# EasyEDA Pro project ProProject_Shield na MachXO3 devboard_2024-06-21.epro

# Schematic Schematic1
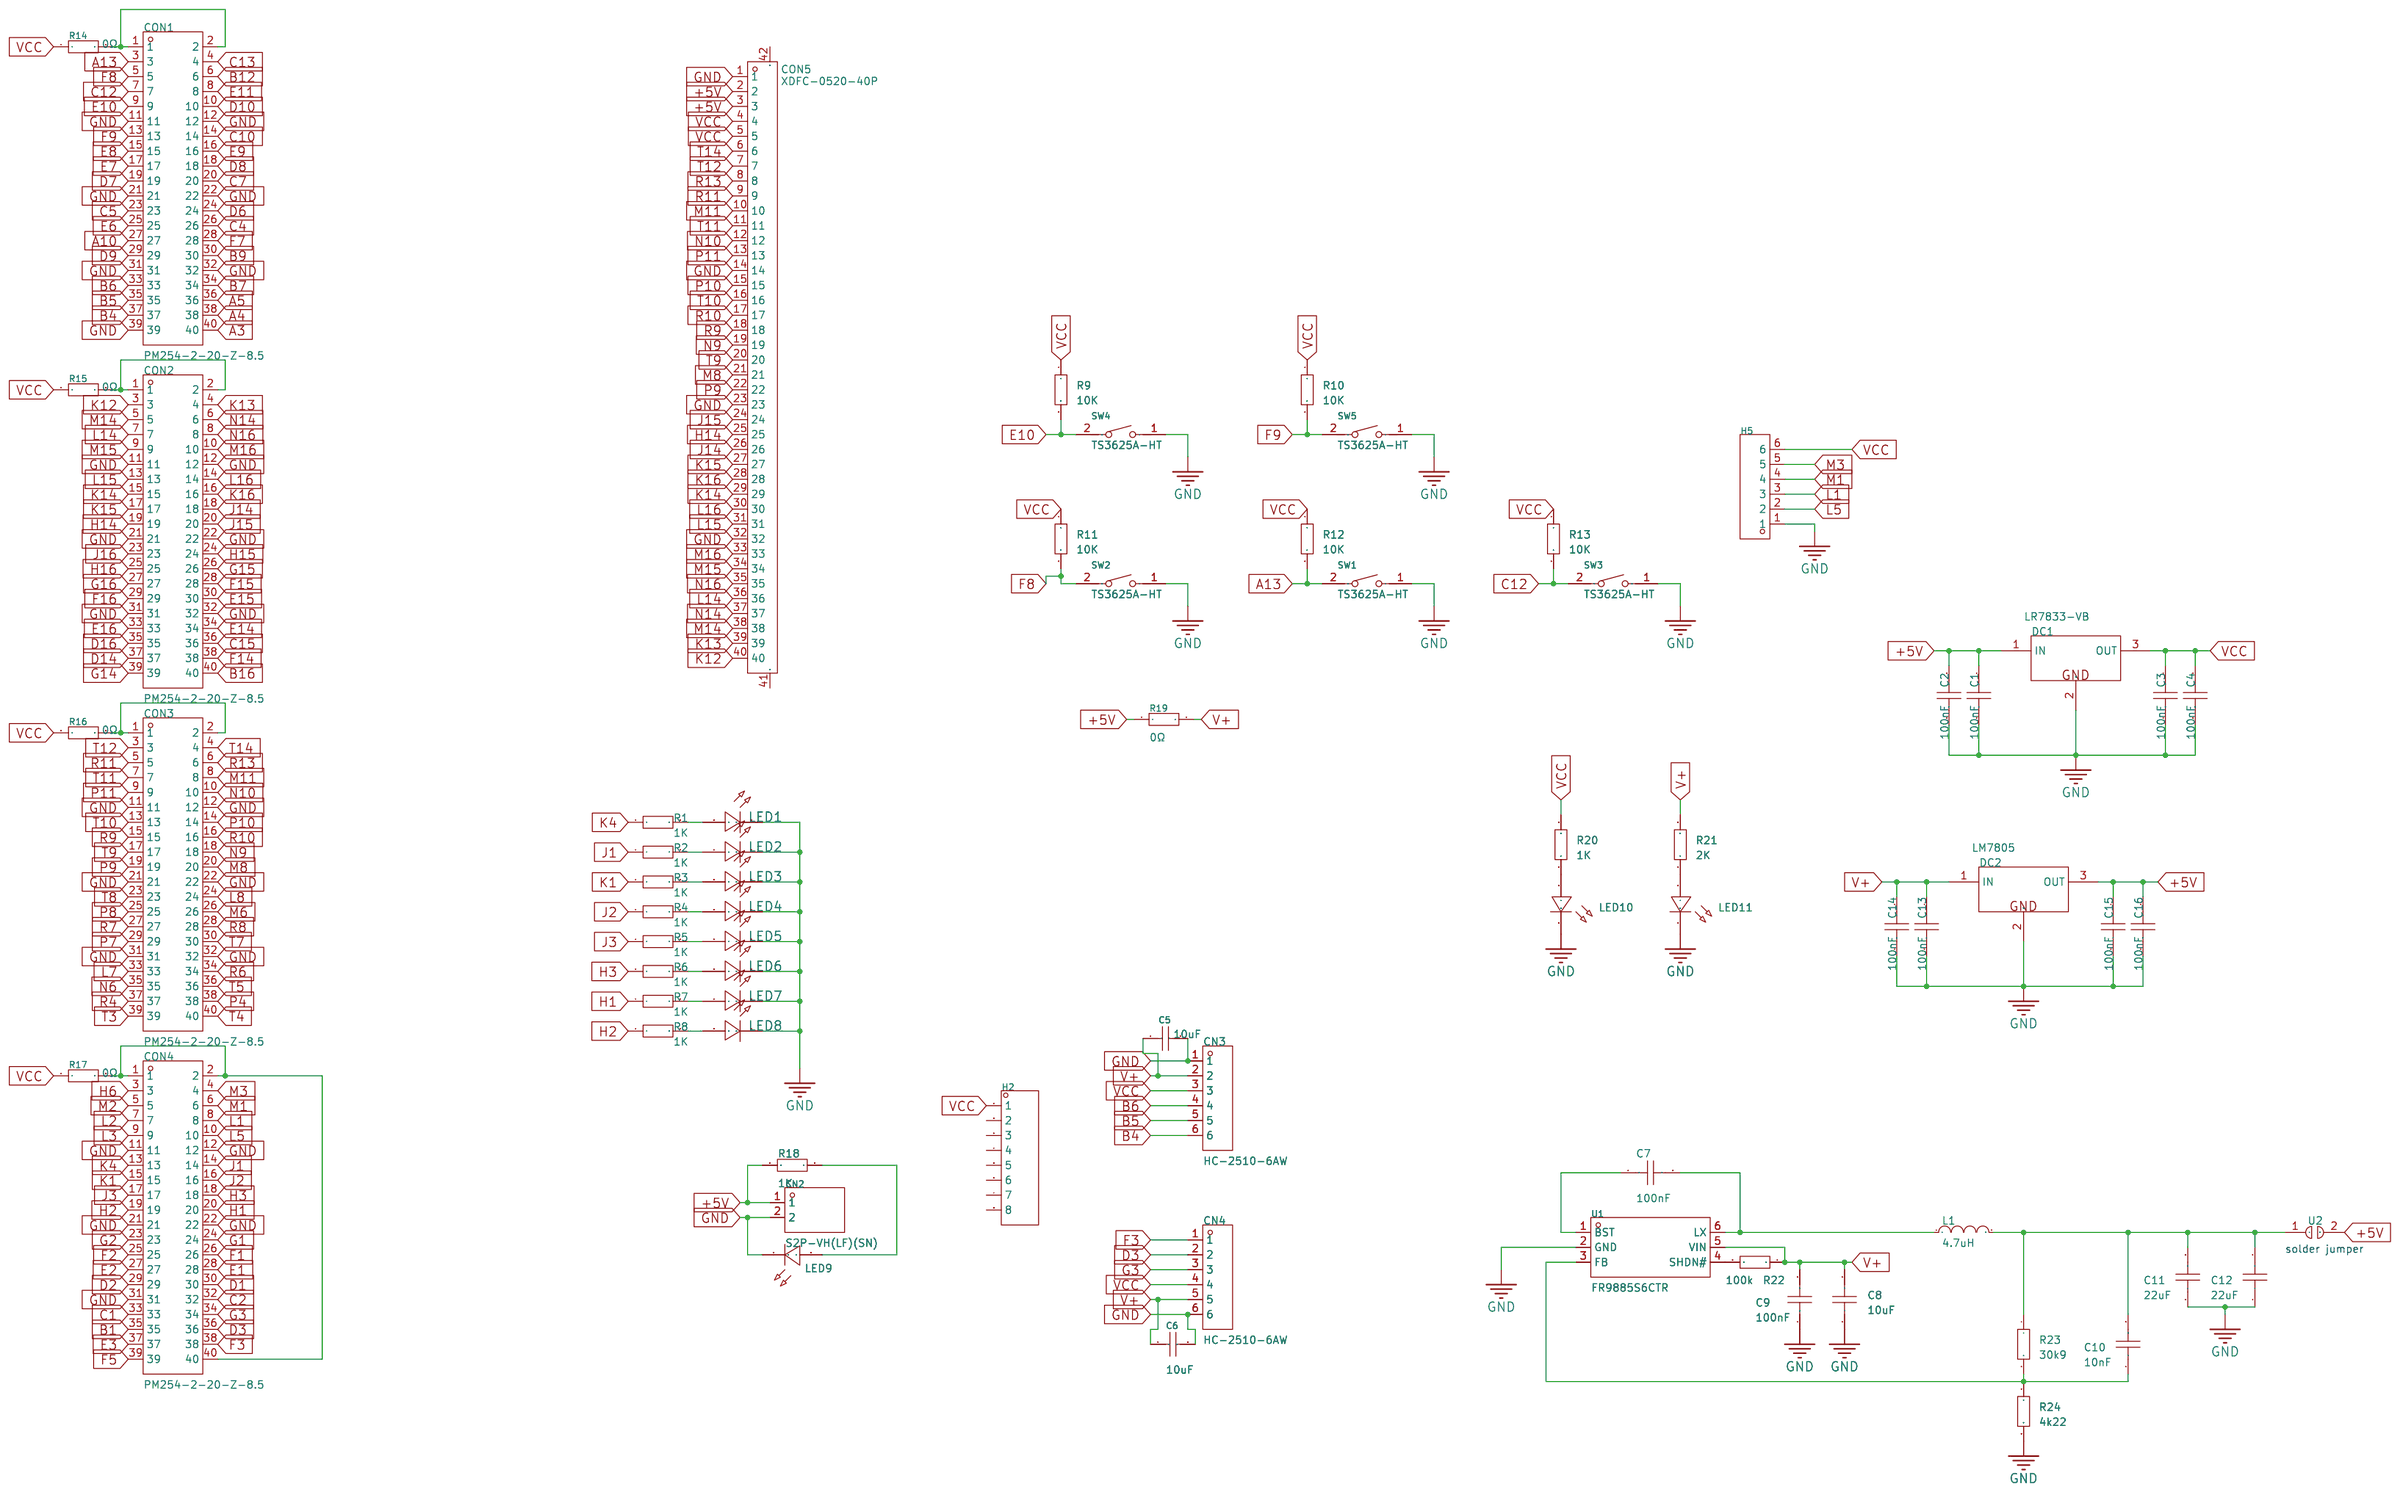
[diagram p0: schematic sheet]

## Parts
C1  100nF  [C0805]
C2  100nF  [C0805]
C3  100nF  [C0805]
C4  100nF  [C0805]
C5  10uF  [C1206]
C6  10uF  [C1206]
C7  100nF  [C0805]
C8  10uF  [C0805]
C9  100nF  [C0805]
C10  10nF  [C0805]
C11  22uF  [C0805]
C12  22uF  [C0805]
C13  100nF  [C0805]
C14  100nF  [C0805]
C15  100nF  [C0805]
C16  100nF  [C0805]
CN2  S2P-VH(LF)(SN)  [CONN-TH_S2P-VH-LF-SN]
CN3  HC-2510-6AW  [CONN-TH_6P-P2.54_HCTL_HC-2510-6AW]
CN4  HC-2510-6AW  [CONN-TH_6P-P2.54_HCTL_HC-2510-6AW]
CON1  PM254-2-20-Z-8.5  [HDR-TH_40P-P2.54-V-F-R2-C20-S2.54]
CON2  PM254-2-20-Z-8.5  [HDR-TH_40P-P2.54-V-F-R2-C20-S2.54]
CON3  PM254-2-20-Z-8.5  [HDR-TH_40P-P2.54-V-F-R2-C20-S2.54]
CON4  PM254-2-20-Z-8.5  [HDR-TH_40P-P2.54-V-F-R2-C20-S2.54]
CON5  XDFC-0520-40P  [conn-smd_40p-p0.50_f31l-1a7h1-21040]
DC1  LR7833-VB  [TO-252-3_L6.5-W5.5-P4.4-LS9.4]
DC2  LM7805  [TO-252-3_L6.5-W6.1-P4.57-LS9.7]
H2  -  [HDR-TH_8P-P2.54-V-M]
H5  -  [HDR-TH_6P-P2.54-V-F]
L1  4.7uH  [IND-SMD_L5.0-W5.0_LVS505040]
LED1  -  [LED0805-RD_GREEN]
LED2  -  [LED0805-RD_GREEN]
LED3  -  [LED0805-RD_GREEN]
LED4  -  [LED0805-RD_GREEN]
LED5  -  [LED0805-RD_GREEN]
LED6  -  [LED0805-RD_GREEN]
LED7  -  [LED0805-RD_GREEN]
LED8  -  [LED0805-RD_GREEN]
LED9  -  [LED0805-RD_GREEN]
LED10  -  [LED0805-RD_GREEN]
LED11  -  [LED0805-RD_GREEN]
R1  1K  [R0603]
R2  1K  [R0603]
R3  1K  [R0603]
R4  1K  [R0603]
R5  1K  [R0603]
R6  1K  [R0603]
R7  1K  [R0603]
R8  1K  [R0603]
R9  10K  [R0603]
R10  10K  [R0603]
R11  10K  [R0603]
R12  10K  [R0603]
R13  10K  [R0603]
R14  0Ω  [R0805]
R15  0Ω  [R0805]
R16  0Ω  [R0805]
R17  0Ω  [R0805]
R18  1K  [R0603]
R19  0Ω  [R0805]
R20  1K  [R0603]
R21  2K  [R0603]
R22  100k  [R0603]
R23  30k9  [R0603]
R24  4k22  [R0603]
SW1  TS3625A-HT  [SW-SMD_L6.1-W3.7-LS7.9]
SW2  TS3625A-HT  [SW-SMD_L6.1-W3.7-LS7.9]
SW3  TS3625A-HT  [SW-SMD_L6.1-W3.7-LS7.9]
SW4  TS3625A-HT  [SW-SMD_L6.1-W3.7-LS7.9]
SW5  TS3625A-HT  [SW-SMD_L6.1-W3.7-LS7.9]
U1  FR9885S6CTR  [SOT-23-6_L2.9-W1.6-P0.95-LS2.8-BR]
U2  -  [Jumper]

## Library data of the parts
C1-C4 C7-C16 = CAP_0805: Supplier Footprint: 0805
C5 C6 = CL31A107MQHNNNE: Capacitance: Tolerance:±20% Tolerance:±20% Voltage Rated: Temperature Coefficient:; LCSC Part Name: 100uF ±20% 6.3V; Supplier Part: C15008; Manufacturer: SAMSUNG(三星); Supplier Footprint: 1206; JLCPCB Part Class: Basic Part; Datasheet: https://atta.szlcsc.com/upload/public/pdf/source/20160218/1457707763339.pdf; Supplier: LCSC; Tolerance: ±20%
CN2 = S2P-VH(LF)(SN): Pins Structure:1x2P Pitch:3.96mm Mounting Style:Right-Angle Reference Series:VH Number of Pins:2P Number of Rows:1 Number of PINs Per Row:2 Row Spacing:- Contact Material:Brass; LCSC Part Name: 系列:VH 间距:3.96mm 1x2P; Supplier Part: C160355; Manufacturer: JST; Supplier Footprint: 弯插,P=3.96mm; JLCPCB Part Class: Extended Part; Datasheet: https://atta.szlcsc.com/upload/public/pdf/source/20180807/C267111_104B2B82EF5D002133F5063D0D7C94AB.pdf; Supplier: LCSC; Pins Structure: 1x2P; Pitch: 3.96mm; Mounting Style: Right-Angle; Reference Series: VH; Number of Pins: 2P; Number of Rows: 1; Number of PINs Per Row: 2; Contact Material: Brass
CN3 CN4 = HC-2510-6AW: Pins Structure:1x6P Pitch:2.54mm Mounting Style:Right-Angle Reference Series:- Number of Pins:6P Number of Rows:1 Number of PINs Per Row:6 Row Spacing:- Current Rating (Max):4A Contact Material:Brass Contact Plating:Tin Operating Temperature Range:-25℃~+8; LCSC Part Name: 1x6P 间距:2.54mm 弯插; Supplier Part: C2982045; Manufacturer: HCTL(华灿天禄); Supplier Footprint: 弯插,P=2.54mm; JLCPCB Part Class: Extended Part; Datasheet: https://atta.szlcsc.com/upload/public/pdf/source/20220311/83CB9A6B67C6DEDDA2AF08A1DCFC516E.pdf; Supplier: LCSC; Pins Structure: 1x6P; Pitch: 2.54mm; Mounting Style: Right-Angle; Number of Pins: 6P; Number of Rows: 1; Number of PINs Per Row: 6; Current Rating (Max): 4A; Contact Material: Brass; Contact Plating: Tin; Operating Temperature Range: -25℃~+85℃
CON1-CON4 = PM254-2-20-Z-8.5: Holes Structure:2x20P Pitch:2.54mm Row Spacing:2.54mm Circular Hole / Square Hole:Square Holes Mounting Type:Straight Number of Rows:双排 Number of Holes:40P Current Rating (Max):3A Voltage Rating (Max):- Holes Direction:Top Insulation Height:8.5mm Contact; LCSC Part Name: 2x20P 间距:2.54mm 直插; Supplier Part: C2897421; Manufacturer: HCTL(华灿天禄); Supplier Footprint: 插件,P=2.54mm; JLCPCB Part Class: Extended Part; Datasheet: https://atta.szlcsc.com/upload/public/pdf/source/20230609/3D36CA2C1BFC9FD1C3F709AD9DFEB9C2.pdf; Supplier: LCSC; Holes Structure: 2x20P; Pitch: 2.54mm; Row Spacing: 2.54mm; Circular Hole / Square Hole: Square Holes; Mounting Type: Straight; Number of Rows: 双排; Number of Holes: 40P; Current Rating (Max): 3A; Holes Direction: Top; Insulation Height: 8.5mm; Contact Material: Copper Alloy; Operating Temperature Range: -40℃~+105℃; Soldering Temperature(Max): 260℃@5S
CON5 = XDFC-0520-40P: Locking Feature:Clamshell Contact Type:Bottom Contact Number of Contacts:40P Pitch:0.5mm Mounting Type:卧贴 FFC, FCB Thickness:0.3mm FFC, FCB Thickness:0.3mm Height Above Board:2mm Contact Material:铜端 Contact Plating:Gold Operating Temperature Range:-40℃~+8; LCSC Part Name: FFC/FPC连接器 PH0.5-40PIN H2.0MM 翻盖式 下接/前翻; Supplier Part: C7527551; Manufacturer: LX(连欣科技); Supplier Footprint: SMD,P=0.5mm; JLCPCB Part Class: Extended Part; Datasheet: https://atta.szlcsc.com/upload/public/pdf/source/20230918/BC9D90A2478B1F11DE066C6B09D8BA06.pdf; Supplier: LCSC; Locking Feature: Clamshell; Contact Type: Bottom Contact; Number of Contacts: 40P; Pitch: 0.5mm; Mounting Type: 卧贴; FFC, FCB Thickness: 0.3mm; Height Above Board: 2mm; Contact Material: 铜端; Contact Plating: Gold; Operating Temperature Range: -40℃~+85℃; Soldering Temperature(Max): 265℃
DC1 = LR7833-VB: Type:1个NChannel Drain Source Voltage (Vdss): Continuous Drain Current (Id): Power Dissipation (Pd):- Drain Source On Resistance (RDS(on)@Vgs,Id):2.3mΩ@10V,120A Gate Threshold Voltage (Vgs(th)@Id):- Total Gate Charge (Qg@Vgs):- Input Capacitance (Ciss@Vds); LCSC Part Name: 1个N沟道 耐压:30V 电流:120A; Supplier Part: C878995; Manufacturer: VBsemi(微碧半导体); Supplier Footprint: TO-252; JLCPCB Part Class: Extended Part; Datasheet: https://atta.szlcsc.com/upload/public/pdf/source/20230505/4B1FBABD0B5DAED78946F7294F64570B.pdf; Supplier: LCSC; Type: 1个NChannel; Drain Source On Resistance (RDS(on)@Vgs,Id): 2.3mΩ@10V,120A; Maximum Input Voltage: 35V; Output Voltage: 5V; MAX Output Current: 500mA; Power Supply Rejection Ratio (PSRR): 62dB@(120Hz); standby current: 6mA; Operating Temperature: -40℃~+125℃; Output Polarity: Positive electrode; Number of Outputs: 1
DC2 = LM7805CS2/TR: Type:1个NChannel Drain Source Voltage (Vdss): Continuous Drain Current (Id): Power Dissipation (Pd):- Drain Source On Resistance (RDS(on)@Vgs,Id):2.3mΩ@10V,120A Gate Threshold Voltage (Vgs(th)@Id):- Total Gate Charge (Qg@Vgs):- Input Capacitance (Ciss@Vds); Supplier Part: C7432232; Manufacturer: HGSEMI(华冠); Supplier Footprint: TO-263-2; JLCPCB Part Class: Extended Part; Datasheet: https://atta.szlcsc.com/upload/public/pdf/source/20240403/D92059E7DEE2CF0CE3DBB6DCDE4B3D67.pdf; Supplier: LCSC; Type: 1个NChannel; Drain Source On Resistance (RDS(on)@Vgs,Id): 2.3mΩ@10V,120A; Maximum Input Voltage: 35V; Output Voltage: 5V; MAX Output Current: 500mA; Power Supply Rejection Ratio (PSRR): 62dB@(120Hz); standby current: 6mA; Operating Temperature: -40℃~+125℃; Output Polarity: Positive electrode; Number of Outputs: 1
H2 = HDR-M_2.54_1x8P: Supplier Footprint: Through
H5 = HDR-F_2.54_1x6P: Supplier Footprint: Through
L1 = L_0402: Supplier Footprint: L0402
LED1-LED8 = LED_0805-R: Supplier Footprint: 0805
LED9 LED11 = LED_0805-G: Supplier Footprint: 0805
LED10 = LED_0805-B: Supplier Footprint: 0805
R1-R13 R18 R20-R24 = Res_0603: Supplier Footprint: 0603
R14-R17 R19 = 0805W8F0000T5E_C17477: Type:Thick Film Resistors Resistance: Tolerance:±1% Tolerance:±1% Power(Watts): Overload Voltage (Max): Temperature Coefficient:±800ppm/℃ Temperature Coefficient:±800ppm/℃ Operating Temperature Range:-55℃~+155℃ Operating Temperature Range:-55℃~+155℃; LCSC Part Name: 0Ω ±1% 125mW 厚膜电阻; Supplier Part: C17477; Manufacturer: UNI-ROYAL(厚声); Manufacturer Part: 0805W8F0000T5E; Supplier Footprint: 0805; JLCPCB Part Class: Basic Part; Datasheet: https://atta.szlcsc.com/upload/public/pdf/source/20200306/C422600_1E6D84923E4A46A82E41ADD87F860B5C.pdf; Supplier: LCSC; Type: Thick Film Resistors; Tolerance: ±1%; Temperature Coefficient: ±800ppm/℃; Operating Temperature Range: -55℃~+155℃
SW1-SW5 = TS3625A-HT: Circuit:SPST Actuator Style:Rectangle button Operating Force:250gf Mounting Style:Brick nogging Switch Length:6.1mm Switch Width:3.65mm Switch Height:2.5mm Contact Current:50mA Voltage Rating (DC):36V With Lamp:- Mechanical Life:-; LCSC Part Name: 6.1*3.65*2.5mm 立贴 轻触开关; Supplier Part: C412368; Manufacturer: SHOU HAN(首韩); Supplier Footprint: SMD,3.7x6.1mm; JLCPCB Part Class: Extended Part; Datasheet: https://atta.szlcsc.com/upload/public/pdf/source/20190816/C412368_ED995B38C5F41C525244887EA1991E6A.pdf; Supplier: LCSC; Circuit: SPST; Actuator Style: Rectangle button; Operating Force: 250gf; Mounting Style: Brick nogging; Switch Length: 6.1mm; Switch Width: 3.65mm; Switch Height: 2.5mm; Contact Current: 50mA; Voltage Rating (DC): 36V
U1 = FR9885S6CTR: Function:Step-down type Input Voltage:- Input Voltage:- Output Current (Max):- Switching Frequency:- Synchronous Rectification:- Number of Outputs:- Topology:- Switch tube (built-in/external):内置; LCSC Part Name: FR9885S6CTR 停产; Supplier Part: C172767; Manufacturer: FITIPOWER(天钰); Supplier Footprint: SOT-23-6; JLCPCB Part Class: Extended Part; Datasheet: https://atta.szlcsc.com/upload/public/pdf/source/20180207/C172767_15179895283361356246.PDF; Supplier: LCSC; Function: Step-down type; Switch tube (built-in/external): 内置
U2 = Jumper

## Nets
+5V: C1.1 C2.1 C15.1 C16.1 CN2.1 CON5.2 CON5.3 DC1.1(IN) DC2.3(OUT) R18.1 R19.1 U2.2
GND: C1.2 C2.2 C3.2 C4.2 C5.2 C6.2 C8.1 C9.1 C11.1 C12.1 C13.2 C14.2 C15.2 C16.2 CN2.2 CN3.1 CN4.6 CON1.11 CON1.12 CON1.21 CON1.22 CON1.31 CON1.32 CON1.39 CON2.11 CON2.12 CON2.21 CON2.22 CON2.31 CON2.32 CON3.11 CON3.12 CON3.21 CON3.22 CON3.31 CON3.32 CON4.11 CON4.12 CON4.21 CON4.22 CON4.31 CON5.1 CON5.14 CON5.23 CON5.32 DC1.2(GND) DC2.2(GND) H5.1 LED1.2(C) LED2.2(C) LED3.2(C) LED4.2(C) LED5.2(C) LED6.2(C) LED7.2(C) LED8.2(C) LED9.1(C) LED10.1(C) LED11.1(C) R24.2 SW1.1(A) SW2.1(A) SW3.1(A) SW4.1(A) SW5.1(A) U1.2(GND)
VCC: C3.1 C4.1 CN3.3 CN4.4 CON5.4 CON5.5 DC1.3(OUT) H2.1 H5.6 R9.1 R10.1 R11.1 R12.1 R13.1 R14.1 R15.1 R16.1 R17.1 R20.2
A3: CON1.40
A4: CON1.38
A5: CON1.36
A10: CON1.27
A13: CON1.3 R12.2 SW1.2(B)
B1: CON4.35
B4: CN3.6 CON1.37
B5: CN3.5 CON1.35
B6: CN3.4 CON1.33
B7: CON1.34
B9: CON1.30
B12: CON1.6
B16: CON2.40
C1: CON4.33
C2: CON4.32
C4: CON1.26
C5: CON1.23
C7: CON1.20
C10: CON1.14
C12: CON1.7 R13.2 SW3.2(B)
C13: CON1.4
C15: CON2.36
D1: CON4.30
D2: CON4.29
D3: CN4.2 CON4.36
D6: CON1.24
D7: CON1.19
D8: CON1.18
D9: CON1.29
D10: CON1.10
D14: CON2.37
D16: CON2.35
E1: CON4.28
E2: CON4.27
E3: CON4.37
E6: CON1.25
E7: CON1.17
E8: CON1.15
E9: CON1.16
E10: CON1.9 R9.2 SW4.2(B)
E11: CON1.8
E14: CON2.34
E15: CON2.30
E16: CON2.33
F1: CON4.26
F2: CON4.25
F3: CN4.1 CON4.38
F5: CON4.39
F7: CON1.28
F8: CON1.5 R11.2 SW2.2(B)
F9: CON1.13 R10.2 SW5.2(B)
F14: CON2.38
F15: CON2.28
F16: CON2.29
G1: CON4.24
G2: CON4.23
G3: CN4.3 CON4.34
G14: CON2.39
G15: CON2.26
G16: CON2.27
H1: CON4.20 R7.1
H2: CON4.19 R8.1
H3: CON4.18 R6.1
H6: CON4.3
H14: CON2.19 CON5.25
H15: CON2.24
H16: CON2.25
J1: CON4.14 R2.1
J2: CON4.16 R4.1
J3: CON4.17 R5.1
J14: CON2.18 CON5.26
J15: CON2.20 CON5.24
J16: CON2.23
K1: CON4.15 R3.1
K4: CON4.13 R1.1
K12: CON2.3 CON5.40
K13: CON2.4 CON5.39
K14: CON2.15 CON5.29
K15: CON2.17 CON5.27
K16: CON2.16 CON5.28
L1: CON4.8 H5.3
L2: CON4.7
L3: CON4.9
L5: CON4.10 H5.2
L7: CON3.33
L8: CON3.24
L14: CON2.7 CON5.36
L15: CON2.13 CON5.31
L16: CON2.14 CON5.30
M1: CON4.6 H5.4
M2: CON4.5
M3: CON4.4 H5.5
M6: CON3.26
M8: CON3.20 CON5.21
M11: CON3.8 CON5.10
M14: CON2.5 CON5.38
M15: CON2.9 CON5.34
M16: CON2.10 CON5.33
N6: CON3.35
N9: CON3.18 CON5.19
N10: CON3.10 CON5.12
N14: CON2.6 CON5.37
N16: CON2.8 CON5.35
P4: CON3.38
P7: CON3.29
P8: CON3.25
P9: CON3.19 CON5.22
P10: CON3.14 CON5.15
P11: CON3.9 CON5.13
R4: CON3.37
R6: CON3.34
R7: CON3.27
R8: CON3.28
R9: CON3.15 CON5.18
R10: CON3.16 CON5.17
R11: CON3.5 CON5.9
R13: CON3.6 CON5.8
T3: CON3.39
T4: CON3.40
T5: CON3.36
T7: CON3.30
T8: CON3.23
T9: CON3.17 CON5.20
T10: CON3.13 CON5.16
T11: CON3.7 CON5.11
T12: CON3.3 CON5.7
T14: CON3.4 CON5.6
V+: C5.1 C6.1 C8.2 C9.2 C13.1 C14.1 CN3.2 CN4.5 DC2.1(IN) R19.2 R21.2 R22.1 U1.5(VIN)
$1N4474: LED1.1(A) R1.2
$1N4477: LED2.1(A) R2.2
$1N4480: LED3.1(A) R3.2
$1N4483: LED4.1(A) R4.2
$1N4486: LED5.1(A) R5.2
$1N4489: LED6.1(A) R6.2
$1N4492: LED7.1(A) R7.2
$1N4495: LED8.1(A) R8.2
$1N6598: CON1.1 CON1.2 R14.2
$1N6621: CON2.1 CON2.2 R15.2
$1N6644: CON3.1 CON3.2 R16.2
$1N6705: CON4.1 CON4.2 CON4.40 R17.2
$1N7555: LED9.2(A) R18.2
$1N9593: LED10.2(A) R20.1
$1N9719: LED11.2(A) R21.1
$1N11752: C7.2 L1.1 U1.6(LX)
$1N11761: C7.1 U1.1(BST)
$1N11843: R22.2 U1.4(SHDN#)
$1N12065: C10.1 R23.2 R24.1 U1.3(FB)
$1N12173: C10.2 C11.2 C12.2 L1.2 R23.1 U2.1

Not connected (* = marked no-connect by the designer): CON5 41 42; H2 2 3 4 5 6 7 8

## Notes on the sheet
- solder jumper

# Board PCB1
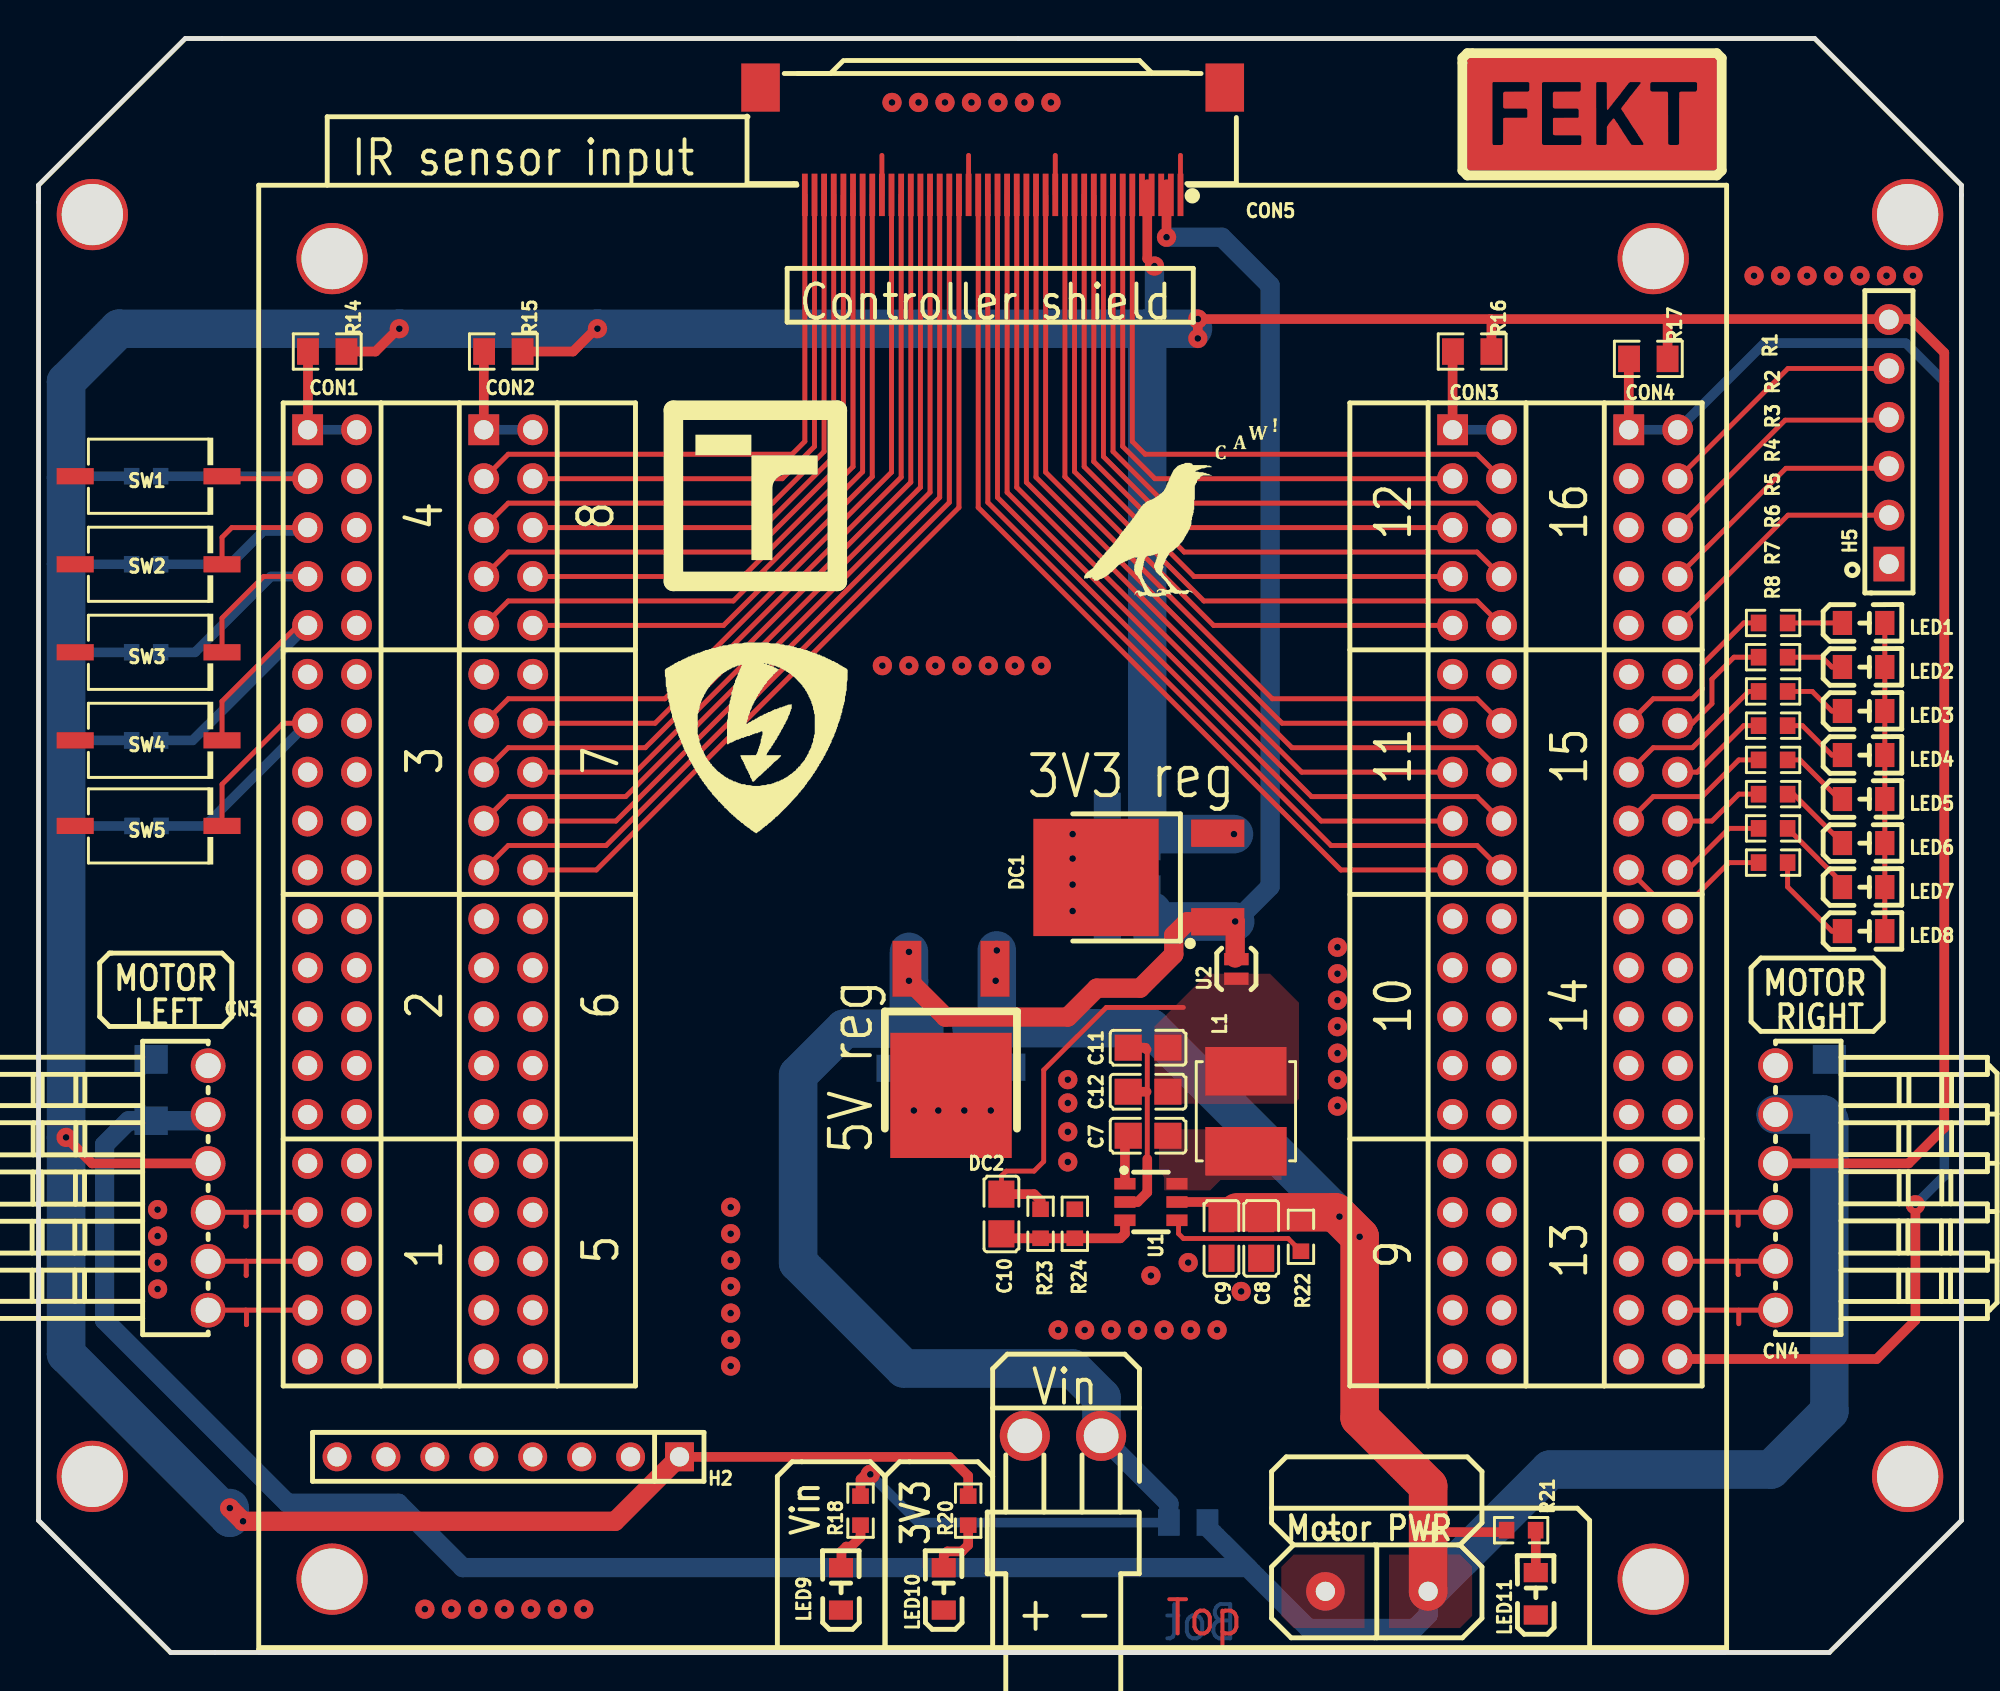
[diagram p1: board, top side]
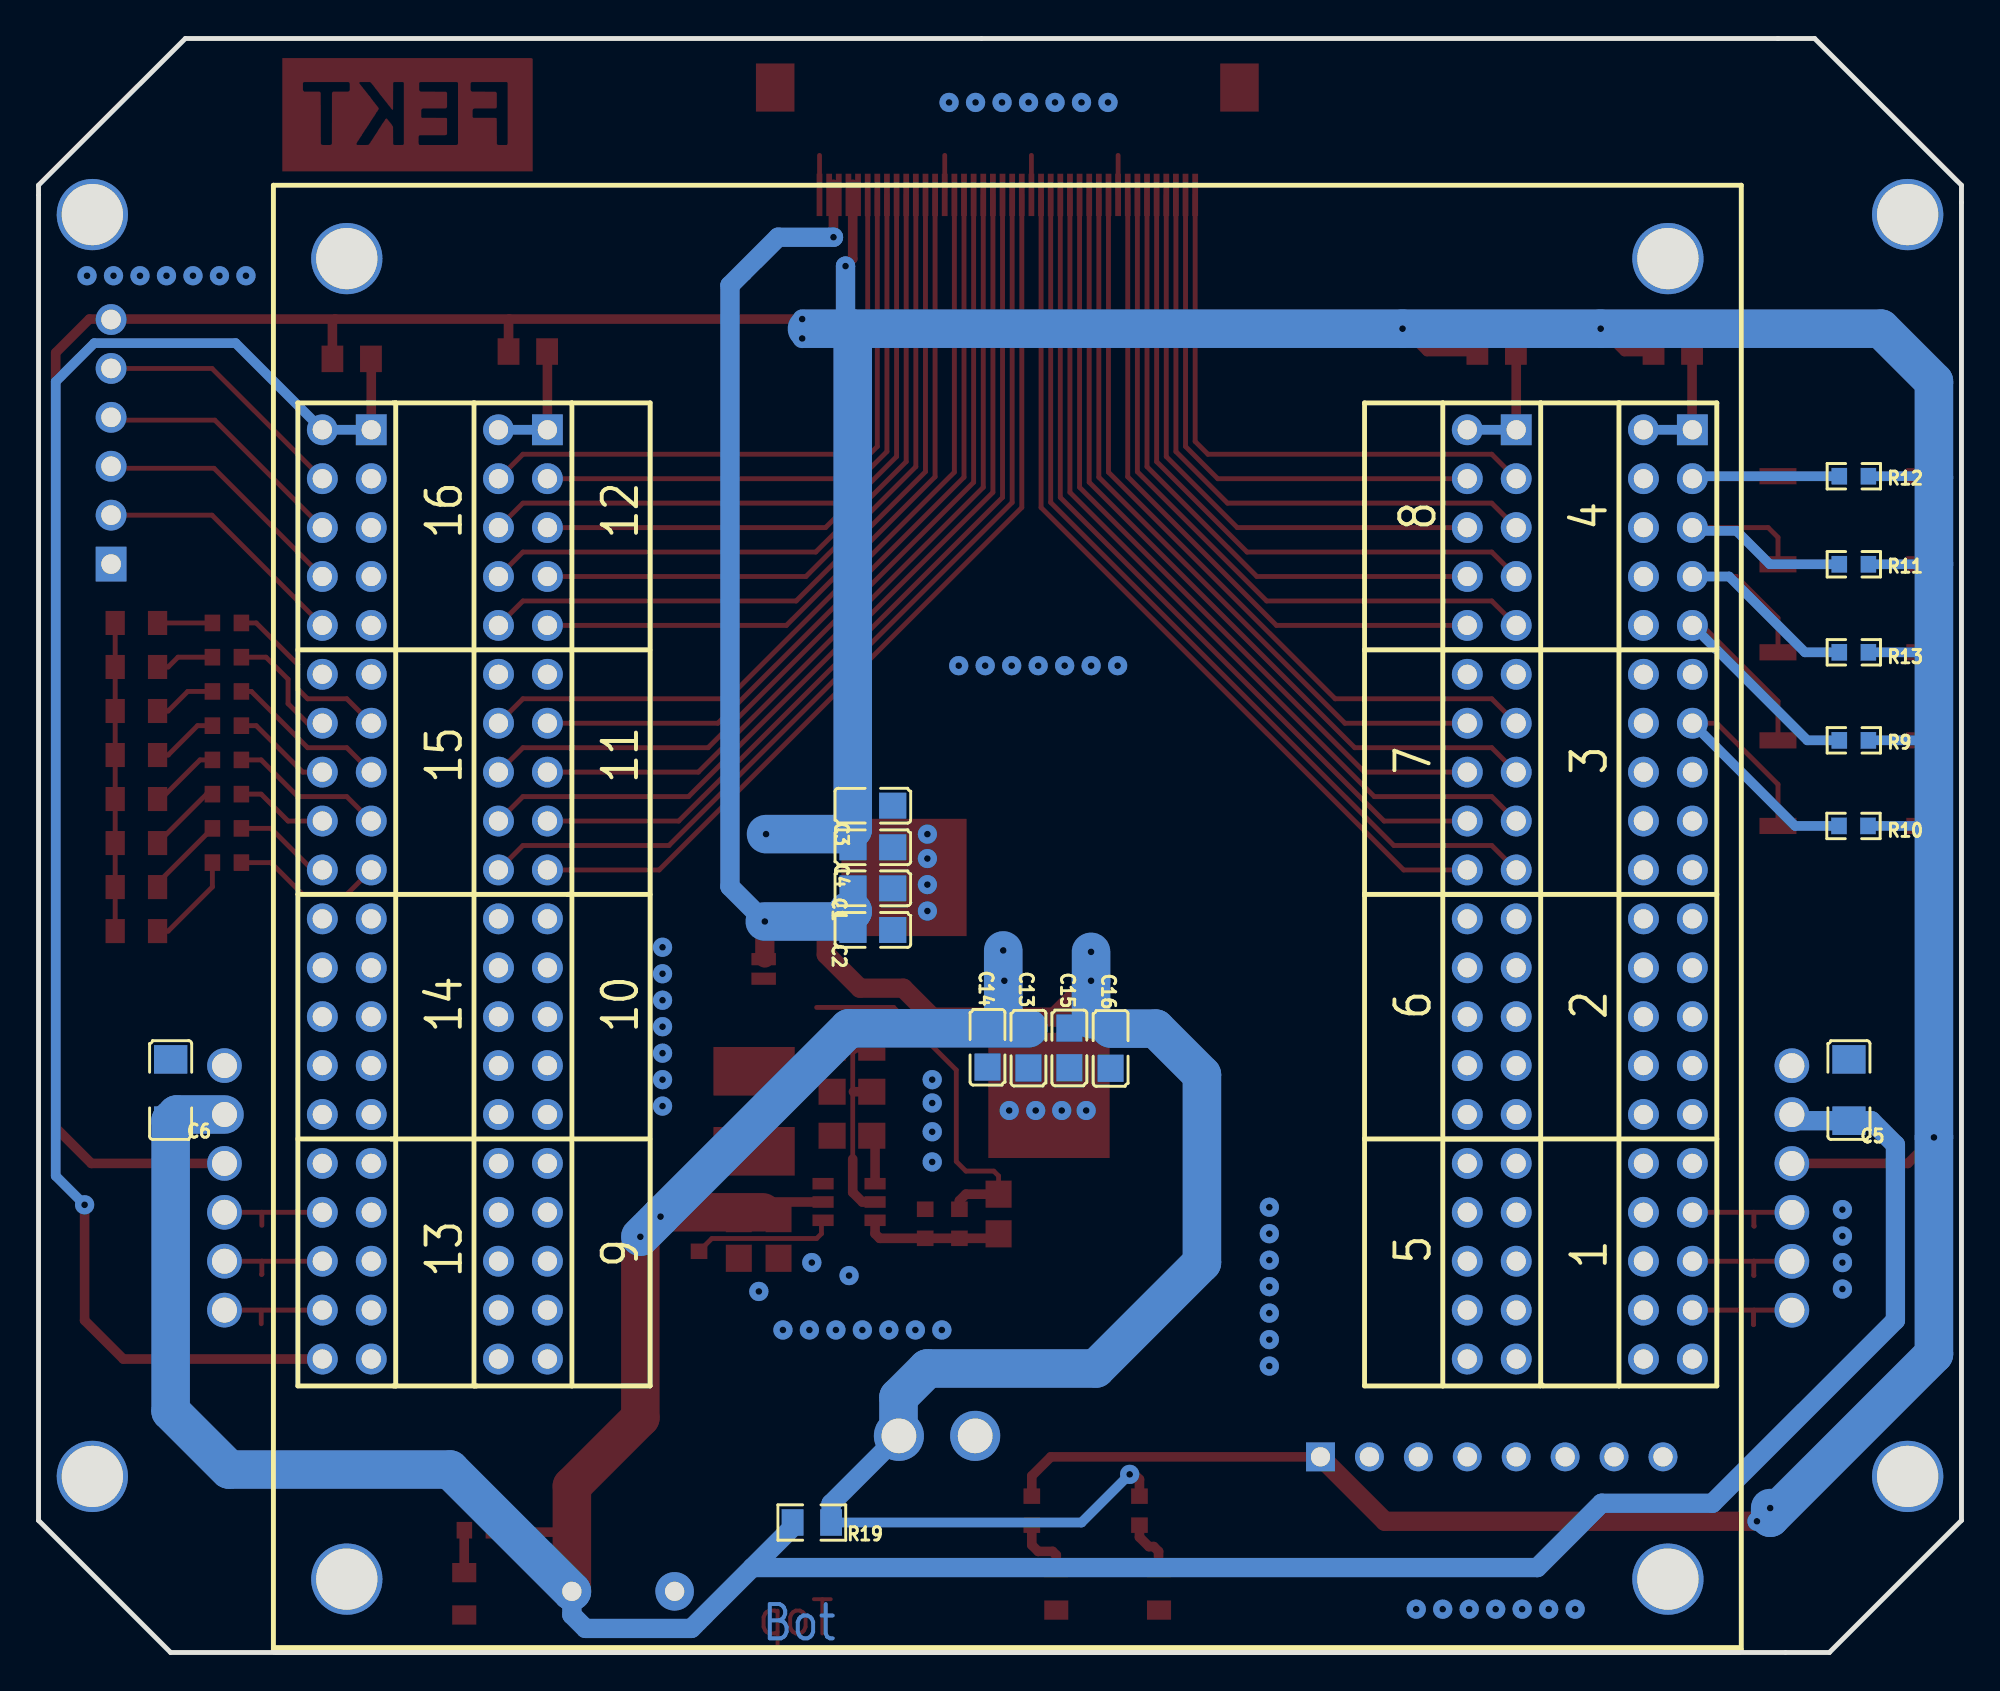
[diagram p2: board, bottom side, seen from below]

Outline 99.82 x 83.82 mm; copper layers: Top Layer, Bottom Layer. Coordinates in mm from the lower left corner of the outline.
Outline path: 0,76.2 0,6.86 6.86,0 92.96,0 99.82,6.86 99.82,76.2 92.2,83.82 7.62,83.82 0,76.2
Stack: Top Layer 0.035mm / Dielectric1 1.51mm FR4 er 4.5 / Bottom Layer 0.035mm

## Design rules (mm)
template: Custom Config
spacing copperThickness1oz (default): track to track 0.102, other pairs 0.152 to 0.3
spacing copperThickness2oz: track to track 0.203, other pairs 0.152 to 0.3
track width copperThickness1oz (default): min 0.127, default 0.254, max 10
track width copperThickness2oz: min 0.203, default 0.254, max 2.54
differential pair differentialPair (default): width min 0.127, default 0.254, max 2.54; gap min 0.152, default 0.152
via viaSize (default): diameter min 0.5, default 0.61, max 10; hole min 0.3, default 0.305, max 6.3

## Placement (name value [footprint] x y rotation side)
C1  100nF  [C0805]  56.51 39.68 180 bottom
C2  100nF  [C0805]  56.51 37.53 180 bottom
C3  100nF  [C0805]  56.51 43.98 180 bottom
C4  100nF  [C0805]  56.51 41.82 180 bottom
C5  10uF  [C1206]  5.84 29.21 90 bottom
C6  10uF  [C1206]  92.96 29.21 90 bottom
C7  100nF  [C0805]  57.6 26.84 0 top
C8  10uF  [C0805]  63.47 21.5 90 top
C9  100nF  [C0805]  61.41 21.5 90 top
C10  10nF  [C0805]  49.99 22.77 90 top
C11  22uF  [C0805]  57.6 31.41 0 top
C12  22uF  [C0805]  57.6 29.12 0 top
C13  100nF  [C0805]  48.43 31.39 270 bottom
C14  100nF  [C0805]  50.56 31.43 270 bottom
C15  100nF  [C0805]  46.31 31.4 270 bottom
C16  100nF  [C0805]  44.17 31.37 270 bottom
CN2  S2P-VH(LF)(SN)  [CONN-TH_S2P-VH-LF-SN]  53.18 11.25 180 top
CN3  HC-2510-6AW  [CONN-TH_6P-P2.54_HCTL_HC-2510-6AW]  8.81 24.12 270 top
CN4  HC-2510-6AW  [CONN-TH_6P-P2.54_HCTL_HC-2510-6AW]  90.17 24.13 90 top
CON1  PM254-2-20-Z-8.5  [HDR-TH_40P-P2.54-V-F-R2-C20-S2.54]  15.24 39.37 270 top
CON2  PM254-2-20-Z-8.5  [HDR-TH_40P-P2.54-V-F-R2-C20-S2.54]  24.38 39.37 270 top
CON3  PM254-2-20-Z-8.5  [HDR-TH_40P-P2.54-V-F-R2-C20-S2.54]  74.68 39.37 270 top
CON4  PM254-2-20-Z-8.5  [HDR-TH_40P-P2.54-V-F-R2-C20-S2.54]  83.82 39.37 270 top
CON5  XDFC-0520-40P  [conn-smd_40p-p0.50_f31l-1a7h1-21040]  49.53 78.49 180 top
DC1  LR7833-VB  [TO-252-3_L6.5-W5.5-P4.4-LS9.4]  58.06 40.25 90 top
DC2  LM7805  [TO-252-3_L6.5-W6.1-P4.57-LS9.7]  47.37 32.22 90 top
H2  -  [HDR-TH_8P-P2.54-V-M]  24.38 10.16 180 top
H5  -  [HDR-TH_6P-P2.54-V-F]  96.06 62.88 90 top
L1  4.7uH  [IND-SMD_L5.0-W5.0_LVS505040]  62.68 28.11 270 top
LED1  -  [LED0805-RD_GREEN]  94.74 53.47 0 top
LED2  -  [LED0805-RD_GREEN]  94.74 51.18 0 top
LED3  -  [LED0805-RD_GREEN]  94.74 48.89 0 top
LED4  -  [LED0805-RD_GREEN]  94.74 46.61 0 top
LED5  -  [LED0805-RD_GREEN]  94.74 44.32 0 top
LED6  -  [LED0805-RD_GREEN]  94.74 42.04 0 top
LED7  -  [LED0805-RD_GREEN]  94.74 39.75 0 top
LED8  -  [LED0805-RD_GREEN]  94.74 37.47 0 top
LED9  -  [LED0805-RD_GREEN]  41.66 3.3 90 top
LED10  -  [LED0805-RD_GREEN]  46.99 3.3 90 top
LED11  -  [LED0805-RD_GREEN]  77.72 3.05 90 top
NOREF  -  [Pad_e1441]  97.03 9.14 0 top
NOREF#2  -  [Pad_e1374]  72.14 3.18 0 top
NOREF#3  -  [Pad_e194]  15.24 3.81 0 top
NOREF#4  -  [Pad_e1433]  97.03 74.68 0 top
NOREF#5  -  [Pad_e1438]  2.79 9.14 0 top
NOREF#6  -  [Pad_e197]  15.24 72.39 0 top
NOREF#7  -  [Pad_e1372]  66.8 3.18 0 top
NOREF#8  -  [Pad_e198]  83.82 72.39 0 top
NOREF#9  -  [Pad_e196]  83.82 3.81 0 top
NOREF#10  -  [Pad_e1432]  2.79 74.68 0 top
R1  1K  [R0603]  90.04 53.47 0 top
R2  1K  [R0603]  90.04 51.69 0 top
R3  1K  [R0603]  90.04 49.91 0 top
R4  1K  [R0603]  90.04 48.13 0 top
R5  1K  [R0603]  90.04 46.36 0 top
R6  1K  [R0603]  90.04 44.58 0 top
R7  1K  [R0603]  90.04 42.8 0 top
R8  1K  [R0603]  90.04 41.02 0 top
R9  10K  [R0603]  5.59 47.37 0 bottom
R10  10K  [R0603]  5.61 42.93 0 bottom
R11  10K  [R0603]  5.59 56.52 0 bottom
R12  10K  [R0603]  5.59 61.09 0 bottom
R13  10K  [R0603]  5.59 51.94 0 bottom
R14  0Ω  [R0805]  14.99 67.56 180 top
R15  0Ω  [R0805]  24.13 67.56 180 top
R16  0Ω  [R0805]  74.42 67.56 180 top
R17  0Ω  [R0805]  83.57 67.18 180 top
R18  1K  [R0603]  42.67 7.37 270 top
R19  0Ω  [R0805]  59.68 6.75 0 bottom
R20  1K  [R0603]  48.26 7.37 90 top
R21  2K  [R0603]  76.96 6.35 180 top
R22  100k  [R0603]  65.53 21.59 270 top
R23  30k9  [R0603]  52.02 22.26 270 top
R24  4k22  [R0603]  53.8 22.26 90 top
SW1  TS3625A-HT  [SW-SMD_L6.1-W3.7-LS7.9]  5.72 61.09 180 top
SW2  TS3625A-HT  [SW-SMD_L6.1-W3.7-LS7.9]  5.72 56.52 180 top
SW3  TS3625A-HT  [SW-SMD_L6.1-W3.7-LS7.9]  5.72 51.94 180 top
SW4  TS3625A-HT  [SW-SMD_L6.1-W3.7-LS7.9]  5.72 47.37 180 top
SW5  TS3625A-HT  [SW-SMD_L6.1-W3.7-LS7.9]  5.72 42.93 180 top
U1  FR9885S6CTR  [SOT-23-6_L2.9-W1.6-P0.95-LS2.8-BR]  57.75 23.4 180 top
U2  -  [Jumper]  62.18 35.5 90 top

## Footprints (pads in the part's own frame, mm; a bottom-side part is the same pattern mirrored in y, then rotated)
C0805
  rect 1.41x1.35 smd: 1(-1.03,0) 2(1.03,0)
C1206
  rect 1.485x1.728 smd: 1(-1.593,0) 2(1.593,0)
conn-smd_40p-p0.50_f31l-1a7h1-21040
  rect 0.3x2.2 smd: 1(-9.75,2.788) 2(-9.25,2.788) 3(-8.75,2.788) 4(-8.25,2.788) 5(-7.75,2.788) 6(-7.25,2.788) 7(-6.75,2.788) 8(-6.25,2.788) 9(-5.75,2.788) 10(-5.25,2.788) 11(-4.75,2.788) 12(-4.25,2.788) 13(-3.75,2.788) 14(-3.25,2.788) 15(-2.75,2.788) 16(-2.25,2.788) 17(-1.75,2.788) 18(-1.25,2.788) 19(-0.75,2.788) 20(-0.25,2.788) 21(0.25,2.788) 22(0.75,2.788) 23(1.25,2.788) 24(1.75,2.788) 25(2.25,2.788) 26(2.75,2.788) 27(3.25,2.788) 28(3.75,2.788) 29(4.25,2.788) 30(4.75,2.788) 31(5.25,2.788) 32(5.75,2.788) 33(6.25,2.788) 34(6.75,2.788) 35(7.25,2.788) 36(7.75,2.788) 37(8.25,2.788) 38(8.75,2.788) 39(9.25,2.788) 40(9.75,2.788)
  rect 2x2.5 smd: 41(-12.05,-2.788) 42(12.05,-2.788)
CONN-TH_6P-P2.54_HCTL_HC-2510-6AW
  round 1.8 hole 1.3: 1(-6.35,0) 2(-3.81,0) 3(-1.27,0) 4(1.27,0) 5(3.81,0) 6(6.35,0)
CONN-TH_S2P-VH-LF-SN
  round 2.6 hole 1.8: 1(-1.98,0) 2(1.98,0)
HDR-TH_6P-P2.54-V-F
  rect 1.8x1.6 hole 1.02: 1(-6.35,0)
  round 1.6 hole 1.02: 2(-3.81,0) 3(-1.27,0) 4(1.27,0) 5(3.81,0) 6(6.35,0)
HDR-TH_8P-P2.54-V-M
  rect 1.5x1.5 hole 1: 1(-8.89,0)
  round 1.5 hole 1: 2(-6.35,0) 3(-3.81,0) 4(-1.27,0) 5(1.27,0) 6(3.81,0) 7(6.35,0) 8(8.89,0)
HDR-TH_40P-P2.54-V-F-R2-C20-S2.54
  rect 1.6x1.6 hole 1: 1(-24.13,-1.27)
  round 1.6 hole 1: 2(-24.13,1.27) 3(-21.59,-1.27) 4(-21.59,1.27) 5(-19.05,-1.27) 6(-19.05,1.27) 7(-16.51,-1.27) 8(-16.51,1.27) 9(-13.97,-1.27) 10(-13.97,1.27) 11(-11.43,-1.27) 12(-11.43,1.27) 13(-8.89,-1.27) 14(-8.89,1.27) 15(-6.35,-1.27) 16(-6.35,1.27) 17(-3.81,-1.27) 18(-3.81,1.27) 19(-1.27,-1.27) 20(-1.27,1.27) 21(1.27,-1.27) 22(1.27,1.27) 23(3.81,-1.27) 24(3.81,1.27) 25(6.35,-1.27) 26(6.35,1.27) 27(8.89,-1.27) 28(8.89,1.27) 29(11.43,-1.27) 30(11.43,1.27) 31(13.97,-1.27) 32(13.97,1.27) 33(16.51,-1.27) 34(16.51,1.27) 35(19.05,-1.27) 36(19.05,1.27) 37(21.59,-1.27) 38(21.59,1.27) 39(24.13,-1.27) 40(24.13,1.27)
IND-SMD_L5.0-W5.0_LVS505040
  rect 2.524x4.22 smd: 1(2.078,0) 2(-2.078,0)
Jumper
  rect 0.635x1.27 smd: 1(-0.508,0) 2(0.508,0)
LED0805-RD_GREEN
  rect 1x1.25 smd: 1(-1.1,0) 2(1.1,0)
Pad_e194
  round 3.7 hole 3.18: 41(0,0)
Pad_e196
  round 3.7 hole 3.18: 41(0,0)
Pad_e197
  round 3.7 hole 3.18: 41(0,0)
Pad_e198
  round 3.7 hole 3.18: 42(0,0)
Pad_e1372
  round 2 hole 1: 43(0,0)
Pad_e1374
  round 2 hole 1: 43(0,0)
Pad_e1432
  round 3.7 hole 3.18: 41(0,0)
Pad_e1433
  round 3.7 hole 3.18: 41(0,0)
Pad_e1438
  round 3.7 hole 3.18: 41(0,0)
Pad_e1441
  round 3.7 hole 3.18: 41(0,0)
R0603
  rect 0.806x0.864 smd: 1(-0.753,0) 2(0.753,0)
R0805
  rect 1.133x1.377 smd: 1(-1,0) 2(1,0)
SOT-23-6_L2.9-W1.6-P0.95-LS2.8-BR
  rect 1.1x0.6 smd: 1(1.35,-0.95) 2(1.35,0) 3(1.35,0.95) 4(-1.35,0.95) 5(-1.35,0) 6(-1.35,-0.95)
SW-SMD_L6.1-W3.7-LS7.9
  rect 1.92x0.84 smd: 1(3.81,0) 2(-3.81,0)
TO-252-3_L6.5-W5.5-P4.4-LS9.4
  rect 1.42x2.76 smd: 1(-2.3,-3.16) 3(2.3,-3.16)
  rect 6.09x6.5 smd: 2(0,3.16)
TO-252-3_L6.5-W6.1-P4.57-LS9.7
  rect 2.9x1.5 smd: 1(3.289,-2.285) 3(3.289,2.285)
  rect 6.5x6.3 smd: 2(-3.289,-0.002)

## Nets
As in the schematic, except:
GND: C1.2 C2.2 C3.2 C4.2 C5.2 C6.2 C8.1 C9.1 C11.1 C12.1 C13.2 C14.2 C15.2 C16.2 CN2.2 CN3.1 CN4.6 CON1.11 CON1.12 CON1.21 CON1.22 CON1.31 CON1.32 CON1.39 CON2.11 CON2.12 CON2.21 CON2.22 CON2.31 CON2.32 CON3.11 CON3.12 CON3.21 CON3.22 CON3.31 CON3.32 CON4.11 CON4.12 CON4.21 CON4.22 CON4.31 CON5.1 CON5.14 CON5.23 CON5.32 DC1.2 DC2.2 H5.1 LED1.2 LED2.2 LED3.2 LED4.2 LED5.2 LED6.2 LED7.2 LED8.2 LED9.1 LED10.1 LED11.1 NOREF.41 NOREF#3.41 NOREF#4.41 NOREF#5.41 NOREF#6.41 NOREF#7.43 NOREF#8.42 NOREF#9.41 NOREF#10.41 R24.2 SW1.1 SW2.1 SW3.1 SW4.1 SW5.1 U1.2
V+: C5.1 C6.1 C8.2 C9.2 C13.1 C14.1 CN3.2 CN4.5 DC2.1 NOREF#2.43 R19.2 R21.2 R22.1 U1.5

Pads without a net: CON5 41 42; H2 2 3 4 5 6 7 8

## Via types
v1: diameter 1, hole 0.35, Top Layer to Bottom Layer, 87 vias

## Routing (per net, layer and track width the routed paths; a pad name or vN(x,y) marks a point on that pad's centre or on a via; arc(x,y) is an arc through that point)
+5V: length 132.9
  Top Layer w0.5: v1(58.56,73.5) 58.56,76.25 ; R18.1 42.67,8.99 42.93,9.25 v1(43.18,9.25)
  Top Layer w1: v1(45.19,34.89) 47.07,33 53.43,33 54.93,34.5 57.18,34.5 58.93,36.25 58.93,37.25 59.63,37.95 DC1.1 ; v1(62.12,37.96) 62.12,36.07
  Bottom Layer w0.5: R19.1 45.68,6.75 v1(43.18,9.25)
  Bottom Layer w1: R19.1 58.68,7.73 CN2.1 ; v1(58.56,73.5) 61.43,73.5 63.93,71 63.93,39.78 v1(62.12,37.96)
  Bottom Layer w2: 45.19,32.89 v1(45.19,34.89) v1(45.19,36.39) ; CN2.1 55.18,11.27 55.18,13.25 53.68,14.75 44.93,14.75 39.43,20.25 39.43,30 41.83,32.4 C16.1 ; v1(62.12,37.96) 58.09,37.96 57.56,38.5 57.81,38.5
GND: length 35.1
  Top Layer w0.25: CON5.32 43.78,77.75 ; 57.56,25.63 57.56,31.5 ; CON5.23 48.28,77.75 ; CON5.1 59.28,77.75 ; CON5.14 52.78,77.75
  Top Layer w0.254: LED8.2 LED7.2 LED6.2 LED5.2 LED4.2 LED3.2 LED2.2 LED1.2
  Top Layer w0.5: 57.52,31.32 57.43,31.41 C11.1 ; U1.2 57.06,23.4 57.56,23.9 57.56,25.62 ; C12.1 57.52,29.12
  vias: v1(6.18,23) v1(6.18,21.62) v1(6.18,20.25) v1(6.18,18.88) v1(20.06,2.25) v1(21.43,2.25) v1(22.81,2.25) v1(24.18,2.25) v1(25.56,2.25) v1(26.93,2.25) v1(28.31,2.25) v1(35.93,23.12) v1(35.93,21.75) v1(35.93,20.38) v1(35.93,19) v1(35.93,17.62) v1(35.93,16.25) v1(35.93,14.88) v1(43.81,51.25) v1(44.31,80.5) v1(45.18,51.25) v1(45.44,28.15) v1(45.68,80.5) v1(46.56,51.25) v1(46.71,28.15) v1(47.06,80.5) v1(47.93,51.25) v1(48.06,28.15) v1(48.43,80.5) v1(49.31,51.25) v1(49.43,28.15) v1(49.81,80.5) v1(50.68,51.25) v1(51.18,80.5) v1(52.06,51.25) v1(52.56,80.5) v1(52.93,16.75) v1(53.43,29.75) v1(53.43,28.54) v1(53.43,27.04) v1(53.43,25.48) v1(53.68,42.5) v1(53.68,41.23) v1(53.68,39.88) v1(53.68,38.51) v1(54.31,16.75) v1(55.68,16.75) v1(57.06,16.75) v1(57.75,19.57) v1(58.43,16.75) v1(59.68,20.25) v1(59.81,16.75) v1(61.18,16.75) v1(62.43,18.75) v1(67.43,36.62) v1(67.43,35.25) v1(67.43,33.88) v1(67.43,32.5) v1(67.43,31.12) v1(67.43,29.75) v1(67.43,28.38) v1(89.06,71.5) v1(90.43,71.5) v1(91.81,71.5) v1(93.18,71.5) v1(94.56,71.5) v1(95.93,71.5) v1(97.31,71.5)
VCC: length 329.3
  Top Layer w0.5: H2.1 47.27,10.16 48.26,9.17 R20.2 ; R15.1 27.74,67.56 28.93,68.75 ; 8.89,25.4 2.78,25.4 v1(1.43,26.75) ; v1(60.18,68.24) v1(60.18,69.25) 75.39,69.25 ; R17.1 84.57,69.11 84.43,69.25 ; 57.56,76.25 57.56,72.37 v1(57.93,72) ; CN4.4 97.08,25.4 98.93,27.25 98.93,67.5 97.18,69.25 84.43,69.25 ; 75.39,69.25 75.42,69.21 R16.1 ; 75.39,69.25 84.43,69.25 ; R14.1 17.49,67.56 18.68,68.75 ; v1(62.06,42.5) 62.01,42.55 DC1.3
  Top Layer w1: v1(9.93,7.5) v1(10.62,6.81) 29.93,6.81 H2.1
  Bottom Layer w0.5: 1.43,56.53 1.45,56.52 R11.1 ; 1.43,61.03 1.49,61.09 R12.1 ; R10.1 1.43,42.93 ; R13.1 1.68,51.94 ; R9.1 1.93,47.37
  Bottom Layer w1: v1(57.93,72) 57.93,69.12 57.56,68.75
  Bottom Layer w2: 57.56,68.75 57.56,42.75 57.81,42.5 v1(62.06,42.5) ; 57.56,68.75 59.93,68.75 ; 57.56,68.75 v1(29.02,68.75) v1(18.73,68.75) 4.18,68.75 1.43,66 v1(1.43,26.75) 1.43,15.5 9.93,7 v1(9.93,7.5)
A13: length 12.2
  Top Layer w0.254: SW1.2 9.65,60.96 CON1.3
  Bottom Layer w0.5: R12.2 13.84,61.09 CON1.3
B4: length 5.9
  Top Layer w0.254: 10.76,17.78 8.89,17.78 ; 10.76,17.78 CON1.37 ; 10.76,17.78 10.8,17.74 10.8,17.03 10.79,17.03
B5: length 5.8
  Top Layer w0.254: 10.78,20.32 8.89,20.32 ; 10.78,20.32 CON1.35 ; 10.78,20.32 10.78,19.59 10.78,19.58
B6: length 5.8
  Top Layer w0.254: 10.78,22.86 8.89,22.86 ; 10.78,22.86 10.78,22.16 10.76,22.14 ; 10.78,22.86 CON1.33
C12: length 16.4
  Top Layer w0.254: SW3.2 9.53,53.72 11.68,55.88 CON1.7
  Bottom Layer w0.5: R13.2 8.12,51.94 12.06,55.88 CON1.7
D3: length 5.8
  Top Layer w0.254: 88.23,20.32 88.23,19.65 88.25,19.63 ; 88.23,20.32 CON4.36 ; 88.23,20.32 CN4.2
E10: length 18.2
  Top Layer w0.254: CON1.9 13.46,53.34 9.53,49.4 SW4.2
  Bottom Layer w0.5: CON1.9 8,47.37 R9.2
F3: length 5.8
  Top Layer w0.254: 88.26,17.78 88.26,17.07 ; CON4.38 CN4.1
F8: length 14.5
  Top Layer w0.254: CON1.5 10.03,58.42 9.53,57.91 SW2.2
  Bottom Layer w0.5: R11.2 9.95,56.52 11.68,58.25 13.8,58.25 CON1.5
F9: length 17.7
  Top Layer w0.254: CON1.13 12.7,48.26 9.53,45.08 SW5.2
  Bottom Layer w0.5: R10.2 8.64,42.93 CON1.13
G3: length 5.8
  Top Layer w0.254: 88.23,22.86 88.23,22.86 88.23,22.19 ; 88.23,22.86 CN4.3 ; 88.23,22.86 CON4.34
H1: length 5.1
  Top Layer w0.254: R7.1 87.76,42.8 85.6,40.64 CON4.20
H2: length 7.9
  Top Layer w0.254: R8.1 87.76,41.02 86.11,39.37 83.82,39.37 CON4.19
H3: length 4.8
  Top Layer w0.254: CON4.18 86.87,43.18 88.27,44.58 R6.1
H14: length 48
  Top Layer w0.254: CON5.25 47.28,59.73 29.46,41.91 24.38,41.91 CON2.19
J1: length 6.4
  Top Layer w0.254: CON4.14 85.85,48.26 86.87,49.28 86.87,50.55 88.01,51.69 R2.1
J2: length 5.2
  Top Layer w0.254: CON4.16 86.11,45.72 88.52,48.13 R4.1
J3: length 8.1
  Top Layer w0.254: R5.1 88.27,46.36 86.36,44.45 83.82,44.45 CON4.17
J14: length 43.8
  Top Layer w0.254: CON5.26 46.78,59.99 29.97,43.18 CON2.18
J15: length 46.2
  Top Layer w0.254: CON5.24 47.78,59.46 28.96,40.64 CON2.20
K1: length 8.5
  Top Layer w0.254: R3.1 88.77,49.91 85.85,46.99 83.82,46.99 CON4.15
K4: length 9.6
  Top Layer w0.254: R1.1 88.52,53.47 86.36,51.31 86.36,50.04 85.85,49.53 83.82,49.53 CON4.13
K12: length 30.3
  Top Layer w0.254: CON2.3 24.38,62.23 39.12,62.23 39.78,62.89 CON5.40
K13: length 28.4
  Top Layer w0.254: CON2.4 38.61,60.96 40.28,62.63 CON5.39
K14: length 43.3
  Top Layer w0.254: CON2.15 24.38,46.99 31.5,46.99 45.28,60.77 CON5.29
K15: length 45.7
  Top Layer w0.254: CON2.17 24.38,44.45 30.48,44.45 46.28,60.25 CON5.27
K16: length 41.4
  Top Layer w0.254: CON2.16 30.99,45.72 45.78,60.51 CON5.28
L1: length 13.3
  Top Layer w0.25: H5.3 95.95,61.5 90.71,61.5 CON4.8
L5: length 13.3
  Top Layer w0.25: CON4.10 90.82,59.07 H5.2
L14: length 35
  Top Layer w0.254: CON5.36 41.78,61.85 37.08,57.15 24.38,57.15 CON2.7
L15: length 41
  Top Layer w0.254: CON5.31 44.28,61.3 32.51,49.53 24.38,49.53 CON2.13
L16: length 39.1
  Top Layer w0.254: CON5.30 44.78,61.04 32,48.26 CON2.14
M1: length 13.3
  Top Layer w0.25: H5.4 95.91,64 90.67,64 CON4.6
M3: length 13.3
  Top Layer w0.25: H5.5 90.82,66.69 CON4.4
M8: length 50.5
  Top Layer w0.254: CON5.21 49.28,59.73 67.1,41.91 74.68,41.91 CON3.20
M11: length 37.5
  Top Layer w0.254: CON5.10 54.78,61.85 59.48,57.15 74.68,57.15 CON3.8
M14: length 32.6
  Top Layer w0.254: CON2.5 24.38,59.69 38.1,59.69 40.78,62.37 CON5.38
M15: length 37.3
  Top Layer w0.254: CON5.34 42.78,61.32 36.07,54.61 24.38,54.61 CON2.9
M16: length 35.5
  Top Layer w0.254: CON2.10 35.56,53.34 43.28,61.06 CON5.33
N9: length 48.2
  Top Layer w0.254: CON5.19 50.28,60.25 66.08,44.45 74.68,44.45 CON3.18
N10: length 39.8
  Top Layer w0.254: CON3.10 74.68,54.61 60.49,54.61 53.78,61.32 CON5.12
N14: length 30.7
  Top Layer w0.254: CON5.37 41.28,62.11 37.59,58.42 CON2.6
N16: length 33.1
  Top Layer w0.254: CON2.8 36.58,55.88 42.28,61.58 CON5.35
P9: length 48.7
  Top Layer w0.254: CON3.19 67.6,40.64 48.78,59.46 CON5.22
P10: length 43.5
  Top Layer w0.254: CON3.14 74.68,49.53 64.05,49.53 52.28,61.3 CON5.15
P11: length 38
  Top Layer w0.254: CON5.13 53.28,61.06 61,53.34 CON3.9
R9: length 43.9
  Top Layer w0.254: CON5.18 50.78,60.51 65.57,45.72 CON3.15
R10: length 45.8
  Top Layer w0.254: CON3.16 74.68,46.99 65.06,46.99 51.28,60.77 CON5.17
R11: length 33.2
  Top Layer w0.254: CON5.9 55.28,62.11 58.97,58.42 CON3.5
R13: length 35.1
  Top Layer w0.254: CON5.8 55.78,62.37 58.46,59.69 74.68,59.69 CON3.6
T9: length 46.3
  Top Layer w0.254: CON3.17 66.59,43.18 49.78,59.99 CON5.20
T10: length 41.6
  Top Layer w0.254: CON3.13 64.56,48.26 51.78,61.04 CON5.16
T11: length 35.6
  Top Layer w0.254: CON5.11 54.28,61.58 59.98,55.88 CON3.7
T12: length 30.9
  Top Layer w0.254: CON5.7 56.28,62.63 57.95,60.96 CON3.3
T14: length 32.8
  Top Layer w0.254: CON3.4 74.68,62.23 57.44,62.23 56.78,62.89 CON5.6
V+: length 199.4
  Top Layer w0.5: U1.5 61.98,23.4 ; 72.68,6.25 76.11,6.25 R21.2
  Top Layer w2: NOREF#2.43 72.14,8.64 68.58,12.19 v1(68.58,21.59) 67.31,22.86 62.23,22.86
  Bottom Layer w1: 62.77,4.41 60.68,6.5 R19.2 ; 62.77,4.41 22.02,4.41 18.68,7.75 12.93,7.75 3.43,17.25 3.43,26.37 4.68,27.62 C5.1 8.49,27.62 CN3.2 8.85,27.98 ; 62.77,4.41 65.93,1.25 71.43,1.25 72.14,1.96 NOREF#2.43
  Bottom Layer w2: v1(49.74,36.46) 49.74,32.89 ; C13.1 57.75,32.42 v1(67.53,22.64) v1(68.58,21.59) ; CN4.5 92.64,27.94 C6.1 92.96,12.53 89.93,9.5 78.46,9.5 NOREF#2.43
  vias: v1(49.69,34.89)
$1N4474: length 2.8
  Top Layer w0.254: R1.2 LED1.1
$1N4477: length 3.1
  Top Layer w0.254: LED2.1 93.09,51.18 92.58,51.69 R2.2
$1N4480: length 3.3
  Top Layer w0.254: R3.2 92.08,49.91 93.09,48.89 LED3.1
$1N4483: length 3.7
  Top Layer w0.254: R4.2 91.57,48.13 93.09,46.61 LED4.1 93.52,46.48
$1N4486: length 3.7
  Top Layer w0.254: R5.2 91.44,46.36 93.47,44.32 LED5.1
$1N4489: length 3.9
  Top Layer w0.254: R6.2 91.1,44.58 LED6.1
$1N4492: length 4.2
  Top Layer w0.254: R7.2 93.64,39.95 LED7.1
$1N4495: length 5.1
  Top Layer w0.254: R8.2 90.8,39.76 93.09,37.47 LED8.1
$1N6598: length 6.6
  Top Layer w0.5: CON1.1 13.99,63.52 R14.2
  Bottom Layer w0.5: CON1.2 CON1.1
$1N6621: length 6.6
  Top Layer w0.5: CON2.1 23.11,67.55 R15.2
  Bottom Layer w0.5: CON2.2 CON2.1
$1N6644: length 6.6
  Top Layer w0.5: R16.2 73.41,67.55 CON3.1
  Bottom Layer w0.5: CON3.2 CON3.1
$1N6705: length 85.3
  Top Layer w0.5: v1(97.43,23.25) 97.43,17.25 95.42,15.24 CON4.40 ; CON4.1 82.55,67.17 R17.2
  Bottom Layer w0.5: v1(97.43,23.25) 98.93,24.75 98.93,66 96.93,68 89.59,68 CON4.2 CON4.1
$1N7555: length 2.8
  Top Layer w0.5: LED9.2 41.68,4.43 41.68,5.25 41.93,5.5 42.18,5.5 42.67,5.99 R18.2
$1N9593: length 3.2
  Top Layer w0.5: R20.1 48.26,5.58 47.93,5.25 47.18,5.25 46.99,5.06 LED10.2
$1N9719: length 2.2
  Top Layer w0.5: R21.1 77.72,6.34 LED11.2
$1N11761: length 2.6
  Top Layer w0.5: U1.1 56.4,26.67 C7.1
$1N11843: length 7.5
  Top Layer w0.25: R22.2 64.87,21.5 59.43,21.5 59.18,21.75 59.18,22.36 U1.4
$1N12065: length 7.3
  Top Layer w0.5: C10.1 50.22,21.51 R23.2 R24.1 56.16,21.51 56.4,21.75 U1.3
$1N12173: length 19.4
  Top Layer w0.25: 59.43,33.5 55.43,33.5 52.18,30.25 52.18,25.5 51.68,25 50.24,25 49.99,24.75 C10.2
  Top Layer w0.5: C10.2 51.68,23.8 52.02,23.47 R23.1

## Copper pours and planes (outline as drawn; the poured copper is in the pictures)
GND on Top Layer: -2.48,86.56 100.89,86.56 100.89,-3.87 -2.48,-3.87
GND on Top Layer: 64.52,5.08 68.83,5.08 68.83,1.27 64.52,1.27
GND on Bottom Layer: -2.23,86.8 101.15,86.8 101.15,-3.88 -2.23,-3.88
V+ on Top Layer: 70.1,5.08 74.42,5.08 74.42,1.27 70.1,1.27
$1N11752 on Top Layer: 58.17,27.18 64.52,27.18 64.52,24 58.17,24
$1N12173 on Top Layer: 57.93,35.25 65.43,35.25 65.43,28.5 57.93,28.5

Small or netless copper shapes (teardrops, artwork), in the pictures only: 1 on Top Layer

## Text on the board
Bottom Layer: Bot
Bottom Silkscreen Layer: 4 | 3 | 2 | 1 | 8 | 7 | 6 | 5 | 12 | 11 | 10 | 9 | 16 | 15 | 14 | 13
Top Layer: Top
Top Silkscreen Layer: MOTOR | LEFT | Motor PWR | - | + | RIGHT | Vin | 3V3 | IR sensor input | Controller shield | + - | 4 | 3 | 2 | 1 | 8 | 7 | 6 | 5 | 12 | 11 | 10 | 9 | 16 | 15 | 14 | 13 | 3V3 reg | 5V reg
